# Altium schematic sheet 05_USB_JTAG.SchDoc
size A3
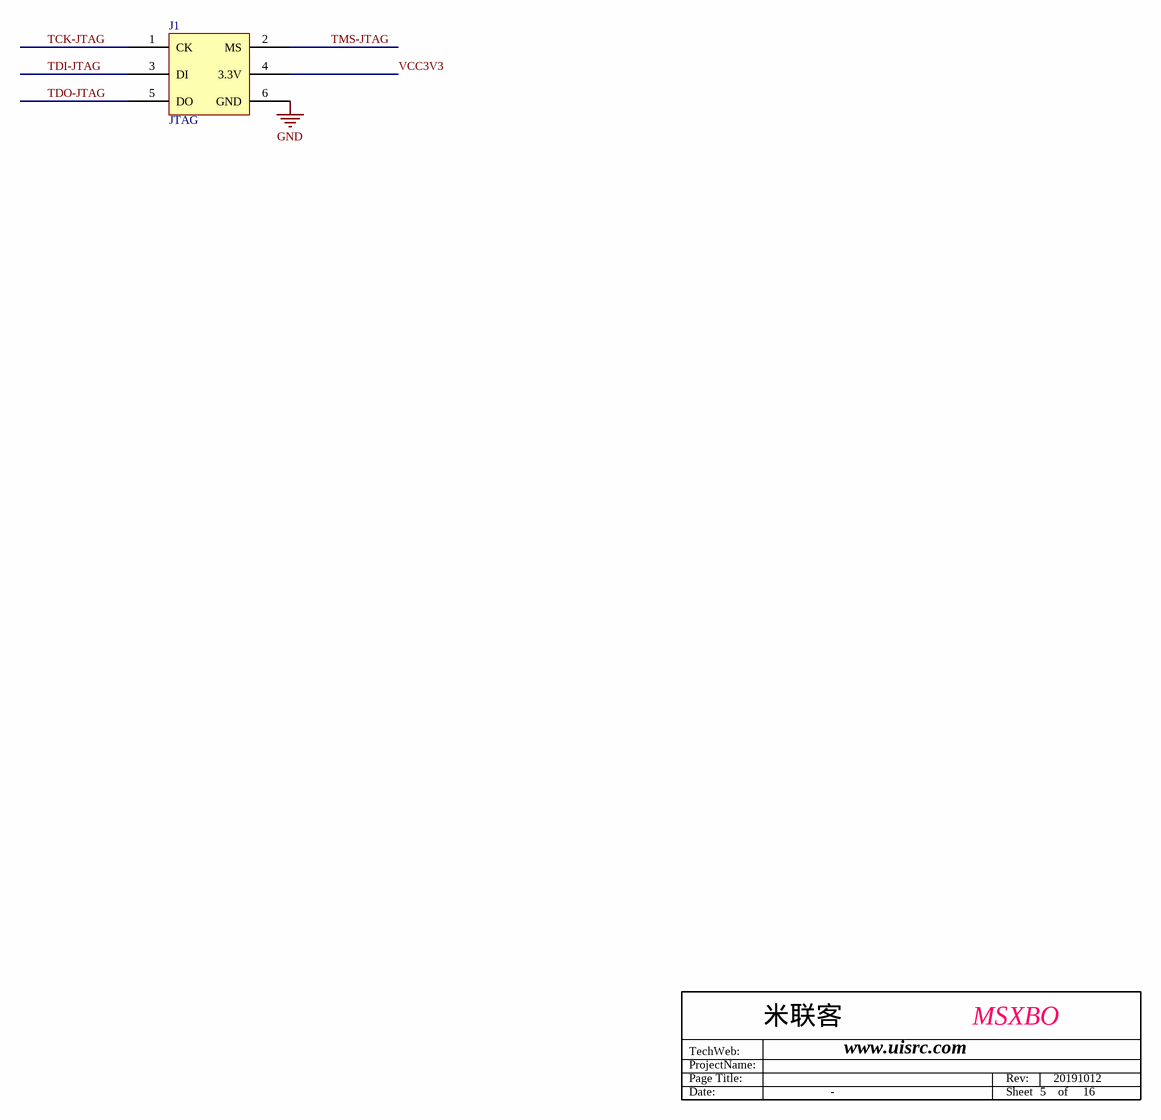
[diagram p0: 05_USB_JTAG.SchDoc]

## Parts
J1  JTAG  [2*3P]

## Nets
GND: J1.6(GND)
TCK-JTAG: J1.1(CK)
TDI-JTAG: J1.3(DI)
TDO-JTAG: J1.5(DO)
TMS-JTAG: J1.2(MS)
VCC3V3: J1.4(3.3V)

## Notes on the sheet
- ProjectName:
- TechWeb:
- Page Title:
- 米联客
- www.uisrc.com
- MSXBO
- Rev:
- 20191012
- Date:
- -
- Sheet
- 5    of     16